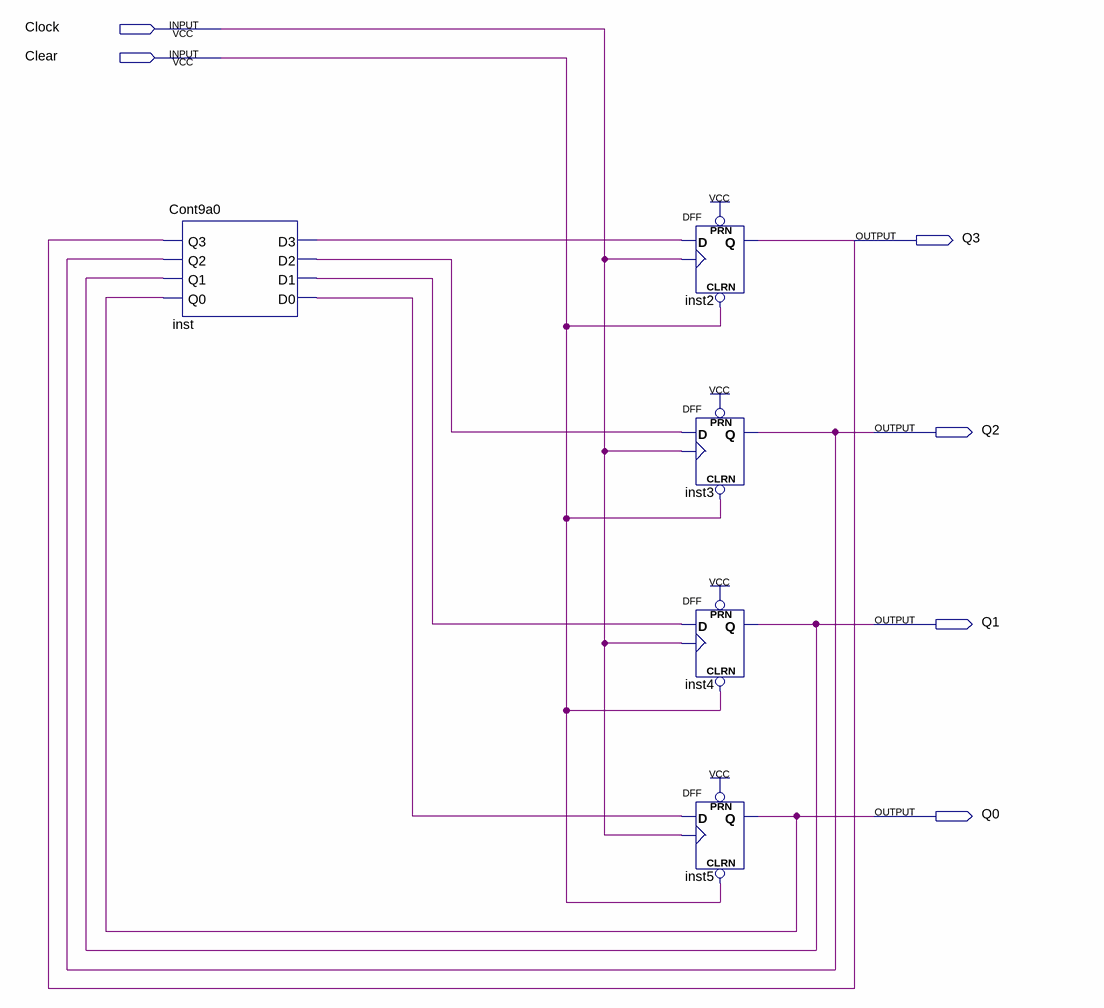
[diagram p0: schematic sheet]
// Quartus schematic Contador9a0.bdf as structural Verilog: 5 symbols, 6 pins
module Contador9a0 (
  input  Clock,
  input  Clear,
  output Q3,
  output Q2,
  output Q1,
  output Q0
);

  wire inst_d0, inst_d1, inst_d2, inst_d3;

  Cont9a0 inst (.Q3(Q3), .Q2(Q2), .Q1(Q1), .Q0(Q0), .D3(inst_d3), .D2(inst_d2), .D1(inst_d1), .D0(inst_d0));
  DFF inst2 (.CLRN(Clear), .CLK(Clock), .D(inst_d3), .PRN(1'b1), .Q(Q3));
  DFF inst3 (.CLRN(Clear), .CLK(Clock), .D(inst_d2), .PRN(1'b1), .Q(Q2));
  DFF inst4 (.CLRN(Clear), .CLK(Clock), .D(inst_d1), .PRN(1'b1), .Q(Q1));
  DFF inst5 (.CLRN(Clear), .CLK(Clock), .D(inst_d0), .PRN(1'b1), .Q(Q0));
endmodule
